# Altium schematic sheet motordriver-v5.0_opto-isolation-general.SchDoc
size A4; SheetNumber: 5; SheetTotal: 9
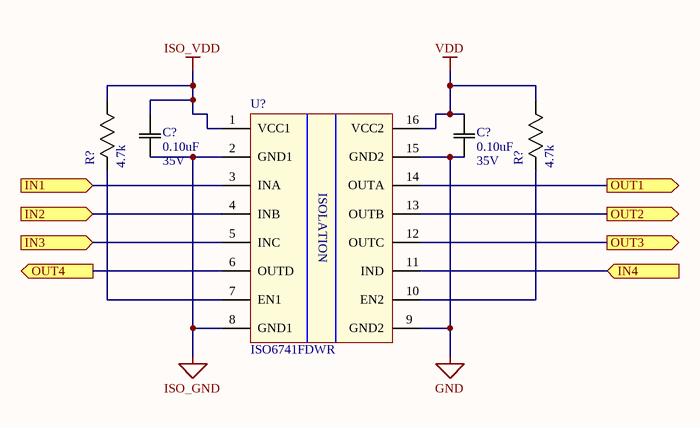
[diagram p0: motordriver-v5.0_opto-isolation-general.SchDoc]

## Parts
(Parts that share a designator on the sheet are numbered #1, #2 ... from top to bottom, then left to right.)
C?#1  Rating: 35V  [0603]  (hidden comment: 0.10uF)
C?#2  Rating: 35V  [0603]  (hidden comment: 0.10uF)
R?#1  4.7k  [0603]
R?#2  4.7k  [0603]
U?  ISO6741FDWR  [16-SOIC]

## Ports
IN1 (in), IN2 (in), IN3 (in), IN4 (in), OUT1 (out), OUT2 (out), OUT3 (out), OUT4 (out)

## Nets
GND: C?#2.1(C1) U?.9(GND2) U?.15(GND2)
ISO_GND: C?#1.1(C1) U?.2(GND1) U?.8(GND1)
ISO_VDD: C?#1.2(C2) R?#1.1(R1) U?.1(VCC1)
VDD: C?#2.2(C2) R?#2.1(R1) U?.16(VCC2)
IN1: U?.3(INA) ; port IN1
IN2: U?.4(INB) ; port IN2
IN3: U?.5(INC) ; port IN3
IN4: U?.11(IND) ; port IN4
OUT1: U?.14(OUTA) ; port OUT1
OUT2: U?.13(OUTB) ; port OUT2
OUT3: U?.12(OUTC) ; port OUT3
OUT4: U?.6(OUTD) ; port OUT4
NetR?#1_2: R?#1.2(R2) U?.7(EN1)
NetR?#2_2: R?#2.2(R2) U?.10(EN2)

## Notes on the sheet
- (in symbol ISO ISO6741FDWR) ISOLATION

## Library data of the parts
C?#1 C?#2 = CAP 0.10uF 35V: CAP CER 0.10UF 35V X7R 0603/0805; Tolerance: 10%; Package: 0603/0805; Temperature Coefficient: X7R; Operating Temperature: -55°C ~ 125°C; Value: 0.10uF
R?#1 R?#2 = RES 4.7k 1/8W - 5%: RES SMD 4.7k OHM 5% 1/8W 0805; Power (Watts): 0.125W; Package: 0805; Value: 4.7k; Tolerance: 5%
U? = ISO ISO6741FDWR: ISO GENERAL-PURPOSE, QUAD-CHANNEL, 3/1; Manufacturer: Texas Instruments; Supplier 1: Digi-Key; Manufacturer Part Number: ISO6741FDWR; RoHS: Yes; Category: Integrated Circuits (ICs); Stock 1: 1835; Pricing 1: 1=2.82000, 10=2.53000, 25=2.39200, 100=2.07320, 250=1.96688, 500=1.76488, 1000=1.75525 (USD); RoHS Compliant: Yes; Supplier Part Number 1: 296-ISO6741FDWRCT-ND